# Altium schematic sheet mini-rfsynth.SchDoc: Mini RF Synth [Master]
size A4; DocumentNumber: 1; SheetNumber: 1; SheetTotal: 1
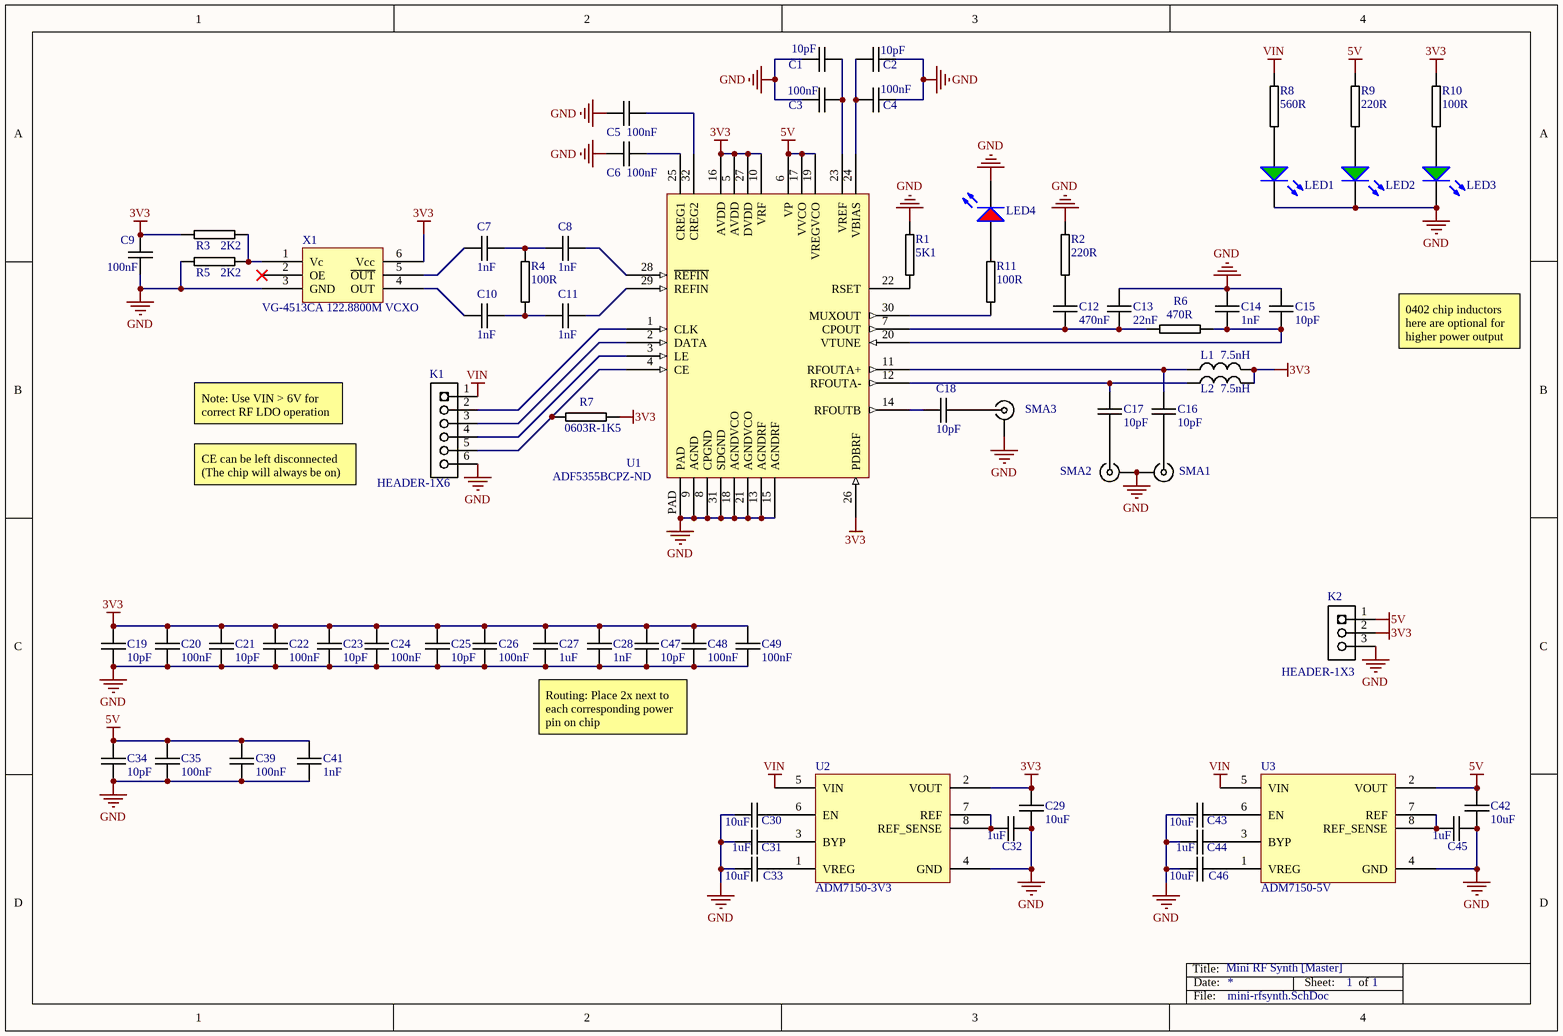
[diagram p0: mini-rfsynth.SchDoc]

## Parts
C1  10pF  [0603C-GENERIC]
C2  10pF  [0603C-GENERIC]
C3  100nF  [0603C-GENERIC]
C4  100nF  [0603C-GENERIC]
C5  100nF  [0603C-GENERIC]
C6  100nF  [0603C-GENERIC]
C7  1nF  [0603C-GENERIC]
C8  1nF  [0603C-GENERIC]
C9  100nF  [0603C-GENERIC]
C10  1nF  [0603C-GENERIC]
C11  1nF  [0603C-GENERIC]
C12  470nF  [0603C-GENERIC]
C13  22nF  [0603C-GENERIC]
C14  1nF  [0603C-GENERIC]
C15  10pF  [0603C-GENERIC]
C16  10pF  [0603C-GENERIC]
C17  10pF  [0603C-GENERIC]
C18  10pF  [0603C-GENERIC]
C19  10pF  [0603C-GENERIC]
C20  100nF  [0603C-GENERIC]
C21  10pF  [0603C-GENERIC]
C22  100nF  [0603C-GENERIC]
C23  10pF  [0603C-GENERIC]
C24  100nF  [0603C-GENERIC]
C25  10pF  [0603C-GENERIC]
C26  100nF  [0603C-GENERIC]
C27  1uF  [0603C-GENERIC]
C28  1nF  [0603C-GENERIC]
C29  10uF  [0805C-GENERIC]
C30  10uF  [0805C-GENERIC]
C31  1uF  [0603C-GENERIC]
C32  1uF  [0603C-GENERIC]
C33  10uF  [0805C-GENERIC]
C34  10pF  [0603C-GENERIC]
C35  100nF  [0603C-GENERIC]
C39  100nF  [0603C-GENERIC]
C41  1nF  [0603C-GENERIC]
C42  10uF  [0805C-GENERIC]
C43  10uF  [0805C-GENERIC]
C44  1uF  [0603C-GENERIC]
C45  1uF  [0603C-GENERIC]
C46  10uF  [0805C-GENERIC]
C47  10pF  [0603C-GENERIC]
C48  100nF  [0603C-GENERIC]
C49  100nF  [0603C-GENERIC]
K1  HEADER-1X6  [HEADER-1X6]
K2  HEADER-1X3  [HEADER-1X3]
L1  7.5nH  [0402_INDUCTOR]
L2  7.5nH  [0402_INDUCTOR]
LED1  Green  [0805LED - GREEN]  (value not drawn)
LED2  Green  [0805LED - GREEN]  (value not drawn)
LED3  Green  [0805LED - GREEN]  (value not drawn)
LED4  Red  [0805LED - RED]  (value not drawn)
R1  5K1  [0603R-GENERIC]
R2  220R  [0603R-220]
R3  2K2  [0603R-2K2]
R4  100R  [0603R-100]
R5  2K2  [0603R-2K2]
R6  470R  [0603R-470]
R7  0603R-1K5  [0603R-1k5]
R8  560R  [0603R-560]
R9  220R  [0603R-220]
R10  100R  [0603R-100]
R11  100R  [0603R-100]
SMA1  MOLEX_SMA_EDGE  [MOLEX_SMA_EDGE]  (value not drawn)
SMA2  MOLEX_SMA_EDGE  [MOLEX_SMA_EDGE]  (value not drawn)
SMA3  MOLEX_SMA_EDGE  [MOLEX_SMA_EDGE]  (value not drawn)
U1  Supplier Part Number 1: ADF5355BCPZ-ND  [AD5355_LFCSP32]  (hidden comment: AD5355)
U2  ADM7150-3V3  [ADM7150_SOIC8EP]
U3  ADM7150-5V  [ADM7150_SOIC8EP]
X1  VG-4513CA 122.8800M VCXO  [VG-4513CA-VCXO]

## Nets
3V3: C9.1 C19.1 C20.1 C21.1 C22.1 C23.1 C24.1 C25.1 C26.1 C27.1 C28.1 C29.1 C47.1 C48.1 C49.1 K2.2 L1.2 L2.2 R3.1 R7.2 R10.1 U1.5(AVDD) U1.10(VRF) U1.16(AVDD) U1.26(PDBRF) U1.27(DVDD) U2.2(VOUT) X1.6(Vcc)
5V: C34.1 C35.1 C39.1 C41.1 C42.1 K2.1 R9.1 U1.6(VP) U1.17(VVCO) U1.19(VREGVCO) U3.2(VOUT)
GND: C1.2 C2.2 C3.2 C4.2 C5.1 C6.1 C9.2 C13.1 C14.1 C15.1 C19.2 C20.2 C21.2 C22.2 C23.2 C24.2 C25.2 C26.2 C27.2 C28.2 C29.2 C30.1 C31.1 C32.1 C33.1 C34.2 C35.2 C39.2 C41.2 C42.2 C43.1 C44.1 C45.1 C46.1 C47.2 C48.2 C49.2 K1.6 K2.3 LED1.K LED2.K LED3.K LED4.K R1.2 R2.1 R5.1 SMA1.2 SMA2.2 SMA3.2 U1.8(CPGND) U1.9(AGND) U1.13(AGNDRF) U1.15(AGNDRF) U1.18(AGNDVCO) U1.21(AGNDVCO) U1.31(SDGND) U1.PAD U2.4(GND) U3.4(GND) X1.3(GND)
VIN: K1.1 R8.1 U2.5(VIN) U3.5(VIN)
NetC1_1: C1.1 C3.1 U1.23(VREF)
NetC2_1: C2.1 C4.1 U1.24(VBIAS)
NetC5_2: C5.2 U1.32(CREG2)
NetC6_2: C6.2 U1.25(CREG1)
NetC7_1: C7.1 X1.5(~{OUT})
NetC7_2: C7.2 C8.1 R4.1
NetC8_2: C8.2 U1.28(~{REFIN})
NetC10_1: C10.1 X1.4(OUT)
NetC10_2: C10.2 C11.1 R4.2
NetC11_2: C11.2 U1.29(REFIN)
NetC12_1: C12.1 R2.2
NetC12_2: C12.2 C13.2 R6.1 U1.7(CPOUT)
NetC14_2: C14.2 C15.2 R6.2 U1.20(VTUNE)
NetC16_1: C16.1 L1.1 U1.11(RFOUTA+)
NetC16_2: C16.2 SMA1.1
NetC17_1: C17.1 L2.1 U1.12(RFOUTA-)
NetC17_2: C17.2 SMA2.1
NetC18_1: C18.1 U1.14(RFOUTB)
NetC18_2: C18.2 SMA3.1
NetC30_2: C30.2 U2.6(EN)
NetC31_2: C31.2 U2.3(BYP)
NetC32_2: C32.2 U2.7(REF) U2.8(REF_SENSE)
NetC33_2: C33.2 U2.1(VREG)
NetC43_2: C43.2 U3.6(EN)
NetC44_2: C44.2 U3.3(BYP)
NetC45_2: C45.2 U3.7(REF) U3.8(REF_SENSE)
NetC46_2: C46.2 U3.1(VREG)
NetK1_2: K1.2 U1.1(CLK)
NetK1_3: K1.3 U1.2(DATA)
NetK1_4: K1.4 U1.3(LE)
NetK1_5: K1.5 R7.1 U1.4(CE)
NetLED1_A: LED1.A R8.2
NetLED2_A: LED2.A R9.2
NetLED3_A: LED3.A R10.2
NetLED4_A: LED4.A R11.2
NetR1_1: R1.1 U1.22(RSET)
NetR3_2: R3.2 R5.2 X1.1(Vc)
NetR11_1: R11.1 U1.30(MUXOUT)

Not connected (* = marked no-connect by the designer): X1 2(OE)*

## Notes on the sheet
- 0402 chip inductors here are optional for higher power output
- Note: Use VIN > 6V for correct RF LDO operation
- CE can be left disconnected (The chip will always be on)
- Routing: Place 2x next to each corresponding power pin on chip
- Title:
- Date:
- Sheet:
- of
- File:

## Library data of the parts
C1 C2 C15-C19 C21 C23 C25 C34 C47 = 0603C-10PF-50V-C0G-MUR: CAPACITOR 0603 CERAMIC; Reel: C2
C3-C6 C9 C20 C22 C24 C26 C35 C39 C48 C49 = 0603C-100NF-50V-X7R-TDK: CAPACITOR 0603 CERAMIC; Manufacturer Part Number: C1608X7R1H103K; Manufacturer: TDK Corporation; Temperature Coefficient: X7R; Tolerance: ±10%; Voltage - Rated: 50V; Capacitance: 10000pF; Reel: C68; RoHS: RoHS Compliant; Lead Spacing: -; Package / Case: 0603 (1608 metric); Features: General Purpose; Packaging: Tape & Reel (TR); Thickness: 0.80mm; Operating Temperature: -55°C ~ 125°C; Mounting Type: Surface Mount, MLCC; Category: Capacitors; Supplier 1: Digi-Key; Supplier Part Number 1: 445-1311-1-ND
C7 C8 C10 C11 C14 C28 C41 = 0603C-1NF-50V-X7R: CAPACITOR 0603 CERAMIC
C12 = 0603C-470NF-25V-X7R-MUR: CAPACITOR 0603 CERAMIC; Manufacturer: Murata Electronics North America; Manufacturer Part Number: GRM188R71E474KA12D; Reel: C14; Temperature Coefficient: X7R; Capacitance: 0.47µF; Voltage - Rated: 25V; Tolerance: ±10%; RoHS: RoHS Compliant; Features: General Purpose; Operating Temperature: -55°C ~ 125°C; Packaging: Tape & Reel (TR); Thickness: 0.80mm; Mounting Type: Surface Mount, MLCC; Lead Spacing: -; Category: Capacitors; Package / Case: 0603 (1608 metric); Supplier: Digi-Key; Supplier Part Number: 490-3291-2-ND; Supplier 1: Digi-Key; Supplier Part Number 1: 490-3291-1-ND
C13 = 0603C-22NF-50V-X7R-TDK: CAPACITOR 0603 CERAMIC; Reel: C89; Supplier 1: Digi-Key; Supplier Part Number 1: 445-1312-2-ND
C27 C31 C32 C44 C45 = 0603C-1UF-16V-X7R-TAY: CAPACITOR 0603 CERAMIC; Manufacturer Part Number: EMK107B7105KA-T; Manufacturer: Taiyo Yuden; Reel: C37; Supplier 1: Digi-Key; Supplier Part Number 1: 587-1241-2-ND
C29 C30 C33 C42 C43 C46 = 0805C-10UF-16V-X5R-TDK: CAPACITOR 0805 CERAMIC; Manufacturer Part Number: C2012X5R1C106M; Manufacturer: TDK Corporation; REEL: C63; Supplier 1: Digi-Key; Supplier Part Number 1: 445-4115-2-ND
L1 L2 = 7.5nH-LQW15AN7N5H00D: Supplier 1: Digi-Key; Supplier Part Number 1: 490-6847-1-ND
LED1-LED3 = 0805 SMD LED - GREEN: Supplier 1: Digi-Key; Supplier Part Number 1: 160-1426-1-ND
LED4 = 0805 SMD LED - RED: Supplier 1: Digi-Key; Supplier Part Number 1: 160-1427-1-ND
R1 = 0603R-5K1: GENERIC RESISTOR 0603; Manufacturer Part Number: RMCF 1/16 15K 1% R; Manufacturer: Stackpole Electronics Inc; Tolerance: ±1%; Resistance In Ohms: 15.0K; Power (Watts): 0.1W, 1/10W; Temperature Coefficient: ±100ppm/°C; Supplier 1: Digi-Key; Supplier Part Number 1: RMCF1/1615KFRTR-ND; Supplier: Digi-Key; Supplier Part Number: RMCF1/1615KFRTR-ND; Packaging: Tape & Reel (TR); Category: Resistors; Case: 0603 (1608 metric); Composition: Thick Film; Lead Style: Surface Mount (SMD - SMT); RoHS: RoHS Compliant
R2 R9 = 0603R-220: GENERIC RESISTOR 0603; Manufacturer: Stackpole Electronics Inc; Manufacturer Part Number: RMCF 1/16 220 1% R; Resistance In Ohms: 220; Power (Watts): 0.1W, 1/10W; Tolerance: ±1%; Temperature Coefficient: ±100ppm/°C; Supplier 1: Digi-Key; Supplier Part Number 1: RMCF1/16220FRCT-ND; Lead Style: Surface Mount (SMD - SMT); Case: 0603 (1608 metric); RoHS: RoHS Compliant; Supplier: Digi-Key; Packaging: Cut Tape (CT); Composition: Thick Film; Supplier Part Number: RMCF1/16220FRCT-ND; Category: Resistors
R3 R5 = 0603R-2K2: GENERIC RESISTOR 0603; Manufacturer Part Number: RMC 1/16 2.2K 1% R; Manufacturer: Stackpole Electronics Inc; REEL: R88; Supplier 1: Digi-Key; Supplier Part Number 1: RMCF0603FT2K20TR-ND
R4 R10 R11 = 0603R-100: GENERIC RESISTOR 0603; Manufacturer Part Number: RMCF 1/16 100 1% R; Manufacturer: Stackpole Electronics Inc; Reel: R24; Supplier 1: Digi-Key; Supplier Part Number 1: RMCF1/16100FRDKR-ND
R6 = 0603R-470: GENERIC RESISTOR 0603; Manufacturer Part Number: RMCF 1/16 470 1% R; Manufacturer: Stackpole Electronics Inc; Tolerance: ±1%; Power (Watts): 0.1W, 1/10W; Temperature Coefficient: ±100ppm/°C; Resistance In Ohms: 470; Reel: R17; Supplier 1: Digi-Key; Supplier Part Number 1: RMCF1/16470FRTR-ND; Supplier: Digi-Key; Composition: Thick Film; Packaging: Tape & Reel (TR); Lead Style: Surface Mount (SMD - SMT); Category: Resistors; RoHS: RoHS Compliant; Supplier Part Number: RMCF1/16470FRTR-ND; Case: 0603 (1608 metric)
R7 = 0603R-1K5: GENERIC RESISTOR 0603; Manufacturer Part Number: RMCF 1/16 15K 1% R; Manufacturer: Stackpole Electronics Inc; Tolerance: ±1%; Resistance In Ohms: 15.0K; Power (Watts): 0.1W, 1/10W; Temperature Coefficient: ±100ppm/°C; Supplier 1: Digi-Key; Supplier Part Number 1: RMCF1/1615KFRTR-ND; Supplier: Digi-Key; Supplier Part Number: RMCF1/1615KFRTR-ND; Packaging: Tape & Reel (TR); Category: Resistors; Case: 0603 (1608 metric); Composition: Thick Film; Lead Style: Surface Mount (SMD - SMT); RoHS: RoHS Compliant
R8 = 0603R-560: GENERIC RESISTOR 0603; Manufacturer: Stackpole Electronics Inc; Manufacturer Part Number: RMC 1/16 560 1% R; Power (Watts): 0.1W, 1/10W; Resistance In Ohms: 560; Temperature Coefficient: ±100ppm/°C; Tolerance: ±1%; Supplier 1: Digi-Key; Supplier Part Number 1: RMC1/16560FR-ND; Case: 0603 (1608 metric); Lead Style: Surface Mount (SMD - SMT); Composition: Thick Film; Supplier Part Number: RMC1/16560FR-ND; RoHS: RoHS Compliant; Category: Resistors; Supplier: Digi-Key; Packaging: Tape & Reel (TR)
K1 = HEADER-1X6: Supplier 1: Digi-Key; Supplier Part Number 1: S1011E-36-ND
K2 = HEADER-1X3: Supplier 1: Digi-Key; Supplier Part Number 1: S1011E-36-ND
SMA1-SMA3 = MOLEX_SMA_EDGE: Supplier 1: Digi-Key; Supplier Part Number 1: WM5534-ND
U1 = AD5355: Supplier 1: Digi-Key
U2 = ADM7150-3V3: Supplier 1: Digi-Key; Supplier Part Number 1: ADM7150ARDZ-3.3-ND
U3 = ADM7150-5V: Supplier 1: Digi-Key; Supplier Part Number 1: ADM7150ARDZ-5.0-ND
X1 = VG-4513CA 122.8800M VCXO: Supplier 1: Digi-Key; Supplier Part Number 1: SER3906CT-ND